# Altium schematic sheet current_conditioning.SchDoc
size A4; SheetNumber: 3; SheetTotal: 13; SPICEModelCacheJNOYGZHY: <root> / <DocumentId>JNOYGZHY</DocumentId> / </root>
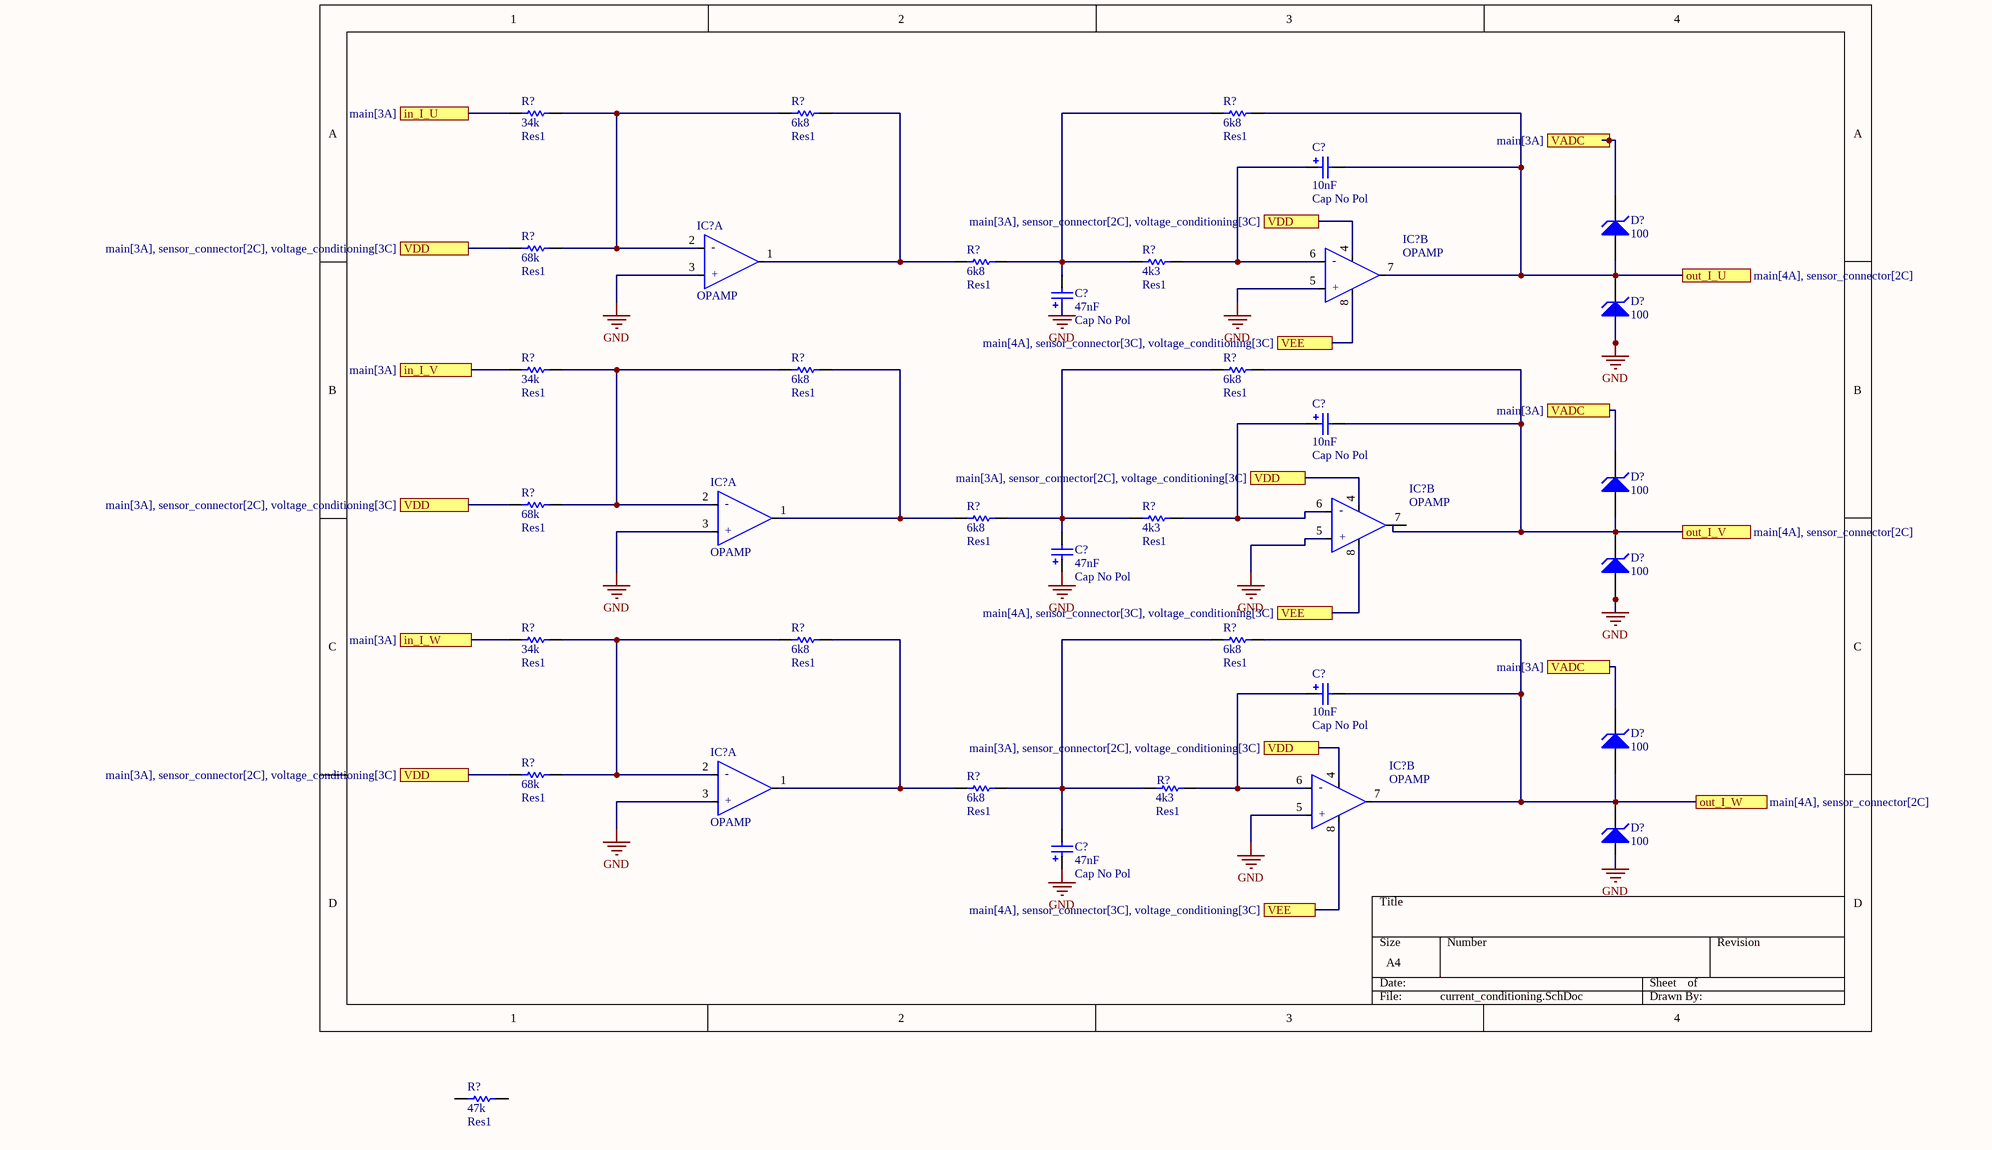
[diagram p0: current_conditioning.SchDoc]

## Parts
(Parts that share a designator on the sheet are numbered #1, #2 ... from top to bottom, then left to right.)
C?#1  Cap No Pol  value 10nF  [RAD-0.1]
C?#2  Cap No Pol  value 47nF  [RAD-0.1]
C?#3  Cap No Pol  value 10nF  [RAD-0.1]
C?#4  Cap No Pol  value 47nF  [RAD-0.1]
C?#5  Cap No Pol  value 10nF  [RAD-0.1]
C?#6  Cap No Pol  value 47nF  [RAD-0.1]
D?#1  BV: 100  (hidden comment: Zener Diode)
D?#2  BV: 100  (hidden comment: Zener Diode)
D?#3  BV: 100  (hidden comment: Zener Diode)
D?#4  BV: 100  (hidden comment: Zener Diode)
D?#5  BV: 100  (hidden comment: Zener Diode)
D?#6  BV: 100  (hidden comment: Zener Diode)
IC?#1  OPAMP  [DIP-8]  (part A of 2)
IC?#2  OPAMP  [DIP-8]  (part B of 2)
IC?#3  OPAMP  [DIP-8]  (part A of 2)
IC?#4  OPAMP  [DIP-8]  (part B of 2)
IC?#5  OPAMP  [DIP-8]  (part A of 2)
IC?#6  OPAMP  [DIP-8]  (part B of 2)
R?#1  Res1  value 34k  [AXIAL-0.3]
R?#2  Res1  value 6k8  [AXIAL-0.3]
R?#3  Res1  value 6k8  [AXIAL-0.3]
R?#4  Res1  value 68k  [AXIAL-0.3]
R?#5  Res1  value 6k8  [AXIAL-0.3]
R?#6  Res1  value 4k3  [AXIAL-0.3]
R?#7  Res1  value 34k  [AXIAL-0.3]
R?#8  Res1  value 6k8  [AXIAL-0.3]
R?#9  Res1  value 6k8  [AXIAL-0.3]
R?#10  Res1  value 68k  [AXIAL-0.3]
R?#11  Res1  value 6k8  [AXIAL-0.3]
R?#12  Res1  value 4k3  [AXIAL-0.3]
R?#13  Res1  value 34k  [AXIAL-0.3]
R?#14  Res1  value 6k8  [AXIAL-0.3]
R?#15  Res1  value 6k8  [AXIAL-0.3]
R?#16  Res1  value 68k  [AXIAL-0.3]
R?#17  Res1  value 6k8  [AXIAL-0.3]
R?#18  Res1  value 4k3  [AXIAL-0.3]
R?#19  Res1  value 47k  [AXIAL-0.3]

## Ports
in_I_U (see main[3A]), in_I_V (see main[3A]), in_I_W (see main[3A]), out_I_U (see main[4A], sensor_connector[2C]), out_I_V (see main[4A], sensor_connector[2C]), out_I_W (see main[4A], sensor_connector[2C]), VADC (see main[3A]), VDD (see main[3A], sensor_connector[2C], voltage_conditioning[3C]), VEE (see main[4A], sensor_connector[3C], voltage_conditioning[3C])

## Nets
GND: C?#2.1 C?#4.1 C?#6.1 D?#2.1(A) D?#4.1(A) D?#6.1(A) IC?#1.3(IN_A_+) IC?#2.5(IN_B_+) IC?#3.3(IN_A_+) IC?#4.5(IN_B_+) IC?#5.3(IN_A_+) IC?#6.5(IN_B_+)
in_I_U: R?#1.1 ; port in_I_U
in_I_V: R?#7.1 ; port in_I_V
in_I_W: R?#13.1 ; port in_I_W
out_I_U: C?#1.2 D?#1.1(A) D?#2.2(K) IC?#2.7(OUT_B) R?#3.2 ; port out_I_U
out_I_V: C?#3.2 D?#3.1(A) D?#4.2(K) IC?#4.7(OUT_B) R?#9.2 ; port out_I_V
out_I_W: C?#5.2 D?#5.1(A) D?#6.2(K) IC?#6.7(OUT_B) R?#15.2 ; port out_I_W
VADC: D?#1.2(K) D?#3.2(K) D?#5.2(K) ; port VADC
VDD: IC?#2.4(-V) IC?#4.4(-V) IC?#6.4(-V) R?#4.1 R?#10.1 R?#16.1 ; port VDD
VEE: IC?#2.8(V+) IC?#4.8(V+) IC?#6.8(V+) ; port VEE
NetC?#1_1: C?#1.1 IC?#2.6(IN_B_-) R?#6.2
NetC?#2_2: C?#2.2 R?#3.1 R?#5.2 R?#6.1
NetC?#3_1: C?#3.1 IC?#4.6(IN_B_-) R?#12.2
NetC?#4_2: C?#4.2 R?#9.1 R?#11.2 R?#12.1
NetC?#5_1: C?#5.1 IC?#6.6(IN_B_-) R?#18.2
NetC?#6_2: C?#6.2 R?#15.1 R?#17.2 R?#18.1
NetIC?#1_1: IC?#1.1(OUT_A) R?#2.2 R?#5.1
NetIC?#1_2: IC?#1.2(IN_A_-) R?#1.2 R?#2.1 R?#4.2
NetIC?#3_1: IC?#3.1(OUT_A) R?#8.2 R?#11.1
NetIC?#3_2: IC?#3.2(IN_A_-) R?#7.2 R?#8.1 R?#10.2
NetIC?#5_1: IC?#5.1(OUT_A) R?#14.2 R?#17.1
NetIC?#5_2: IC?#5.2(IN_A_-) R?#13.2 R?#14.1 R?#16.2

Not connected (* = marked no-connect by the designer): R?#19 1 2

## Notes on the sheet
- (in symbol ADTL082, part A) -; +
- (in symbol ADTL082, part B) -; +

## Library data of the parts
C?#1-C?#6 = Cap No Pol: Polarized Capacitor (Radial); Published: 8-Jun-2000; LatestRevisionDate: 17-Jul-2002; LatestRevisionNote: Re-released for DXP Platform.; PackageReference: RB7.6-15; Publisher: Altium Limited; PackageDescription: Polarized Capacitor (Radial); 2 Leads
D?#1-D?#6 = Zener Diode: AF: 1; BV_MAX: 1e99; CJO: 0; EG: 1.11; FC: 0.5; IBV: 0.001; IS: 1e-14; MJSW: 0.33; NTUN: 30; TNOM: 27; XTI: 3; SimulationGenericComponent: True; CJP: 0; CTA: 0; CTP: 0; FCS: 0.5; FV_MAX: 1e99; IKF: 0; IKR: 0; ISR: 1e-14; JSW: 0; JTUN: 0; JTUNSW: 0; KEG: 1; KF: 0; LEVEL: 1; N: 1; NBV: 1; NR: 1; NS: 1; PHP: 1; RS: 0; TCV: 0; TLEV: 0; TLEVC: 0; TM1: 0; TM2: 0; TPB: 0; TPHP: 0; TRS: 0; TRS2: 0; TT: 0; TTT1: 0; TTT2: 0; VJ: 1; XTITUN: 3
IC?#1-IC?#6 = ADTL082
R?#1-R?#19 = Res1: Resistor; Published: 8-Jun-2000; LatestRevisionDate: 17-Jul-2002; LatestRevisionNote: Re-released for DXP Platform.; PackageReference: AXIAL-0.3; Publisher: Altium Limited; PackageDescription: Axial Device, Thru-Hole; 2 Leads; 0.3 in Pin Spacing